# Altium project ISL6236_V01.PrjPcb
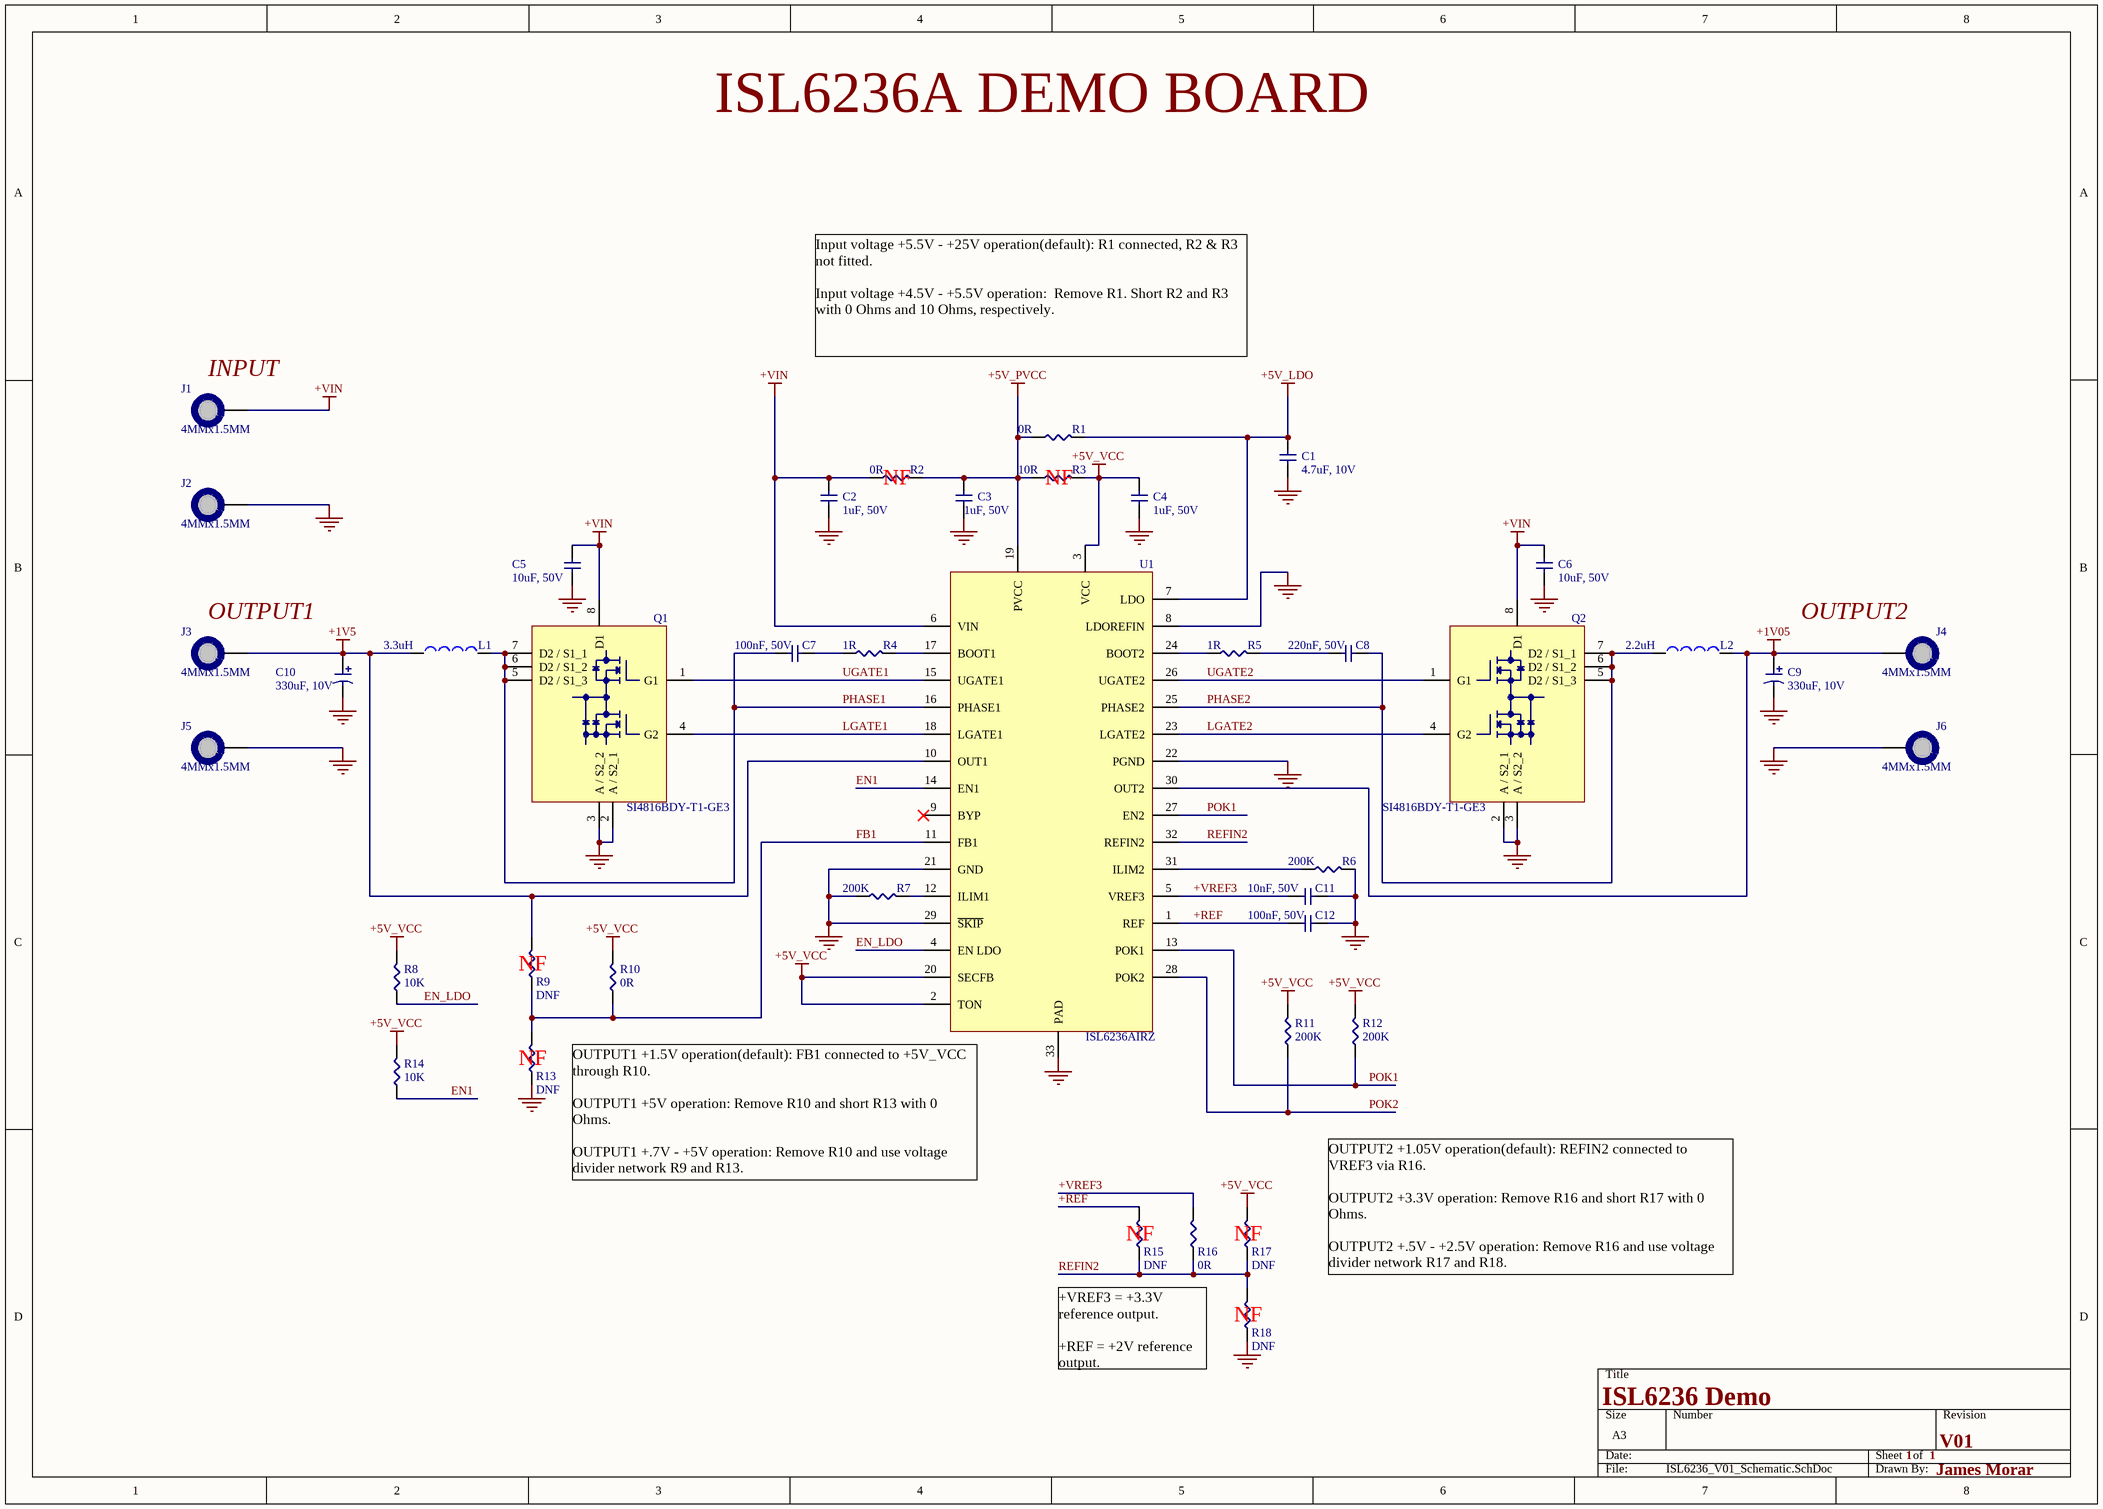
[diagram p0: ISL6236_V01_Schematic.SchDoc]
1 sheet, 41 parts. Net scope: global (net labels, ports and power ports of the same name join across sheets).
Board file: ISL6236_V01_PCB.PcbDoc

## Sheet ISL6236_V01_Schematic.SchDoc
size A3

### Parts
C1  4.7uF, 10V  [C1206]
C2  1uF, 50V  [C0805]
C3  1uF, 50V  [C0805]
C4  1uF, 50V  [C0805]
C5  10uF, 50V  [C1210]
C6  10uF, 50V  [C1210]
C7  100nF, 50V  [C0805]
C8  220nF, 50V  [C0805]
C9  330uF, 10V  [7343-43]
C10  330uF, 10V  [7343-43]
C11  10nF, 50V  [C0805]
C12  100nF, 50V  [C0805]
J1  4MMx1.5MM  [PAD_4MMx1.5MM]
J2  4MMx1.5MM  [PAD_4MMx1.5MM]
J3  4MMx1.5MM  [PAD_4MMx1.5MM]
J4  4MMx1.5MM  [PAD_4MMx1.5MM]
J5  4MMx1.5MM  [PAD_4MMx1.5MM]
J6  4MMx1.5MM  [PAD_4MMx1.5MM]
L1  3.3uH  [DR125]
L2  2.2uH  [DR125]
Q1  SI4816BDY-T1-GE3  [SO8]
Q2  SI4816BDY-T1-GE3  [SO8]
R1  0R  [R0805]
R2  0R  [R0805]
R3  10R  [R0805]
R4  1R  [R0805]
R5  1R  [R0805]
R6  200K  [R0805]
R7  200K  [R0805]
R8  10K  [R0805]
R9  DNF  [R0805]
R10  0R  [R0805]
R11  200K  [R0805]
R12  200K  [R0805]
R13  DNF  [R0805]
R14  10K  [R0805]
R15  DNF  [R0805]
R16  0R  [R0805]
R17  DNF  [R0805]
R18  DNF  [R0805]
U1  ISL6236AIRZ  [ISL6236_LQFN32]

### Nets
+1V5: C10.1 J3.1 L1.1 R9.2 U1.10(OUT1)
+1V05: C9.1 J4.1 L2.2 U1.30(OUT2)
+5V_LDO: C1.2 R1.2 U1.7(LDO)
+5V_PVCC: C3.2 R1.1 R2.2 R3.1 U1.19(PVCC)
+5V_VCC: C4.2 R3.2 R8.2 R10.2 R11.2 R12.1 R14.2 R17.2 U1.2(TON) U1.3(VCC) U1.20(SECFB)
+VIN: C2.2 C5.2 C6.2 J1.1 Q1.8(D1) Q2.8(D1) R2.1 U1.6(VIN)
GND: C1.1 C2.1 C3.1 C4.1 C5.1 C6.1 C9.2 C10.2 C11.2 C12.2 J2.1 J5.1 J6.1 Q1.2(A_/_S2_1) Q1.3(A_/_S2_2) Q2.2(A_/_S2_1) Q2.3(A_/_S2_2) R6.2 R7.1 R13.1 R18.1 U1.8(LDOREFIN) U1.21(GND) U1.22(PGND) U1.29(~{SKIP}) U1.33(PAD)
+REF: C12.1 R15.2 U1.1(REF)
+VREF3: C11.1 R16.2 U1.5(VREF3)
EN1: R14.1 U1.14(EN1)
EN_LDO: R8.1 U1.4(EN_LDO)
FB1: R9.1 R10.1 R13.2 U1.11(FB1)
LGATE1: Q1.4(G2) U1.18(LGATE1)
LGATE2: Q2.4(G2) U1.23(LGATE2)
PHASE1: C7.2 L1.2 Q1.5(D2_/_S1_3) Q1.6(D2_/_S1_2) Q1.7(D2_/_S1_1) U1.16(PHASE1)
PHASE2: C8.1 L2.1 Q2.5(D2_/_S1_3) Q2.6(D2_/_S1_2) Q2.7(D2_/_S1_1) U1.25(PHASE2)
POK1: R12.2 U1.13(POK1) U1.27(EN2)
POK2: R11.1 U1.28(POK2)
REFIN2: R15.1 R16.1 R17.1 R18.2 U1.32(REFIN2)
UGATE1: Q1.1(G1) U1.15(UGATE1)
UGATE2: Q2.1(G1) U1.26(UGATE2)
NetC7_1: C7.1 R4.1
NetC8_2: C8.2 R5.2
NetR4_2: R4.2 U1.17(BOOT1)
NetR5_1: R5.1 U1.24(BOOT2)
NetR6_1: R6.1 U1.31(ILIM2)
NetR7_2: R7.2 U1.12(ILIM1)

Not connected (* = marked no-connect by the designer): U1 9(BYP)*

### Notes on the sheet
- ISL6236A DEMO BOARD
- (near J1) INPUT
- Input voltage +5.5V - +25V operation(default): R1 connected, R2 & R3 not fitted.
  Input voltage +4.5V - +5.5V operation:  Remove R1. Short R2 and R3 with 0 Ohms and 10 Ohms, respectively.
- (near R2) NF
- (near R3) NF
- (near J3) OUTPUT1
- OUTPUT2
- (near R9) NF
- (near R13) NF
- (near U1) OUTPUT1 +1.5V operation(default): FB1 connected to +5V_VCC through R10.
  OUTPUT1 +5V operation: Remove R10 and short R13 with 0 Ohms.
  OUTPUT1 +.7V - +5V operation: Remove R10 and use voltage divider network R9 and R13.
- (near R15) NF
- (near R17) NF
- (near R18) NF
- OUTPUT2 +1.05V operation(default): REFIN2 connected to VREF3 via R16.
  OUTPUT2 +3.3V operation: Remove R16 and short R17 with 0 Ohms.
  OUTPUT2 +.5V - +2.5V operation: Remove R16 and use voltage divider network R17 and R18.
- +VREF3 = +3.3V reference output.
  +REF = +2V reference output.
- ISL6236 Demo
- 1
- V01
- James Morar

### Library data of the parts
C1 = C1206C475K8PACTU: KEMET         C1206C475K8PACTU             SMD Multilayer Ceramic Capacitor, 1206 [3216 Metric], 4.7 F, 10 V,  10%, X5R, C Series; Capacitance: 4.7 μF; Special Features: High CV; Tolerance: -10, +10 %; Voltage, Rating: 10 VDC; Supplier 1: Mouser; Manufacturer: KEMET; Manufacturer Part Number: C1206C475K8PACTU; Stock 1: 3191; Pricing 1: 1=0.48, 10=0.304, 100=0.192, 500=0.162, 1000=0.144, 2000=0.114 (USD); Brand/Series: C Series; Case Size: 1206 (3216 mm); Dielectric Characteristic: X5R; Dimensions: 0.126" x 0.063" (3.2 x 1.6mm) LxW; Material, Element: Ceramic; Mounting Type: PCB; Packaging: Cut Tape; Series: C1206 Series; Termination: SMD; ComponentLink1URL: http://www.alliedelec.com/m/d/9bfe7773041ffe9d406e68bc7b377fdd.pdf?src-supplier=Allied+Electronics; ComponentLink1Description: http://www.alliedelec.com/m/d/9bfe7773041ffe9d406e68bc7b377fdd.pdf?src-supplier=Allied+Electronics; ComponentLink2URL: http://www.jameco.com/Jameco/Products/ProdDS/1568870.pdf?src-supplier=Jameco; ComponentLink2Description: http://www.jameco.com/Jameco/Products/ProdDS/1568870.pdf?src-supplier=Jameco; Supplier Part Number 1: 80-C1206C475K8P
C2-C4 = 08055C105KAZ4A: Manufacturer: Kyocera AVX; Supplier 1: Mouser; Manufacturer Part Number: 08055C105KAZ4A; Stock 1: 7924; Pricing 1: 1=0.38, 10=0.264, 100=0.159, 500=0.119, 1000=0.1, 2500=0.085 (USD); Supplier Part Number 1: 581-08055C105KAZ4A
C5 C6 = C1210C106K5PACTU: KEMET - C1210C106K5PACTU - SMD Multilayer Ceramic Capacitor, 10 µF, 50 V, 1210 [3225 Metric], ± 10%, X5R, C Series KEMET; Product Training Modules: Capacitor Basics- Typical Uses for Capacitors; Capacitance: 10µF; Dynamic Catalog: X5R Dielectric (Commercial Grade); Other Names: 399-11402-6; Supplier 1: Mouser; Manufacturer: KEMET; Manufacturer Part Number: C1210C106K5PACTU; Stock 1: 17950; Pricing 1: 1=1.29, 10=0.986, 100=0.705, 500=0.546, 1000=0.382, 2000=0.363, 10000=0.349, 25000=0.28 (USD); Standard Package: 1; Category: Capacitors; Family: Ceramic Capacitors; Series: -; Packaging: Digi-Reel®; Tolerance: ±10%; Voltage - Rated: 50V; Temperature Coefficient: X5R; Mounting Type: Surface Mount, MLCC; Operating Temperature: -55°C ~ 85°C; Applications: General Purpose; Ratings: -; Package / Case: 1210 (3225 Metric); Size / Dimension: 0.126" L x 0.098" W (3.20mm x 2.50mm); Height - Seated (Max): -; Thickness (Max): *; Lead Spacing: -; Features: -; Lead Style: -; ComponentLink1URL: https://api.kemet.com/component-edge/download/datasheet/C1210C106K5PACTU.pdf?src-supplier=Digi-Key; ComponentLink1Description: https://api.kemet.com/component-edge/download/datasheet/C1210C106K5PACTU.pdf?src-supplier=Digi-Key; Supplier Part Number 1: 80-C1210C106K5P
C7 C12 = C0805C104K5RAC7411: Cap Ceramic 0.1uF 50V X7R 10% SMD 0805 125C Paper T/R; Manufacturer: KEMET; Rad Hard: No; Voltage: 50 Vdc; Product Length: 2 mm; Product Height: 0.9 mm; Product Depth: 1.25 mm; Supplier 1: Mouser; Manufacturer Part Number: C0805C104K5RAC7411; Stock 1: 57173; Pricing 1: 1=0.1, 10=0.049, 100=0.032, 500=0.03, 1000=0.025, 2000=0.021 (USD); Packaging: Tape & Reel; Package/Case: 0805; Mounting: Surface Mount; Capacitance Value: 0.1 uF; Tolerance: 10 %; Dielectric: X7R; Operating Temperature: -55 to 125 °C; Construction: Flat; Category: Capacitor Ceramic Multilayer; ComponentLink1URL: https://www.verical.com/server-webapp/html/getDatasheet?partID=248513&src-supplier=Verical; ComponentLink1Description: https://www.verical.com/server-webapp/html/getDatasheet?partID=248513&src-supplier=Verical; ComponentLink2URL: http://components.arrow.com/part/dataview/30748302S8994022N7429?src-supplier=Arrow; ComponentLink2Description: http://components.arrow.com/part/dataview/30748302S8994022N7429?src-supplier=Arrow; ComponentLink3URL: http://components.arrow.com/part/dataview/0323_00325482?src-supplier=Arrow+Europe; ComponentLink3Description: http://components.arrow.com/part/dataview/0323_00325482?src-supplier=Arrow+Europe; Supplier Part Number 1: 80-C0805C104K5RACLR
C8 = C0805F224K5RACAUTO: Cap Ceramic 0.22uF 50V X7R 10% SMD 0805 125°C Embossed Plastic T/R; Manufacturer: KEMET; Capacitance: .22uF; Voltage: 50VDC; Case Style: Ceramic Chip; Wire Form: Not Required; Product Length (mm): 2mm; Product Depth (mm): 1.25mm; Product Diameter (mm): Not Requiredmm; Supplier 1: Mouser; Manufacturer Part Number: C0805F224K5RACAUTO; Stock 1: 3880; Pricing 1: 1=0.57, 10=0.363, 100=0.219, 500=0.198, 1000=0.168, 2500=0.13 (USD); Tolerance (+ or -): 10%; Temp Coeff (Dielectric): X7R; Operating Temp Range: -55C to 125C; Mounting Style: Surface Mount; Package / Case: 0805; Construction: SMT Chip; Failure Rate: Not Required; Product Height (mm): 1.25mm; Packaging: Tape and Reel; ComponentLink1URL: http://components.arrow.com/part/dataview/0323_04088687?src-supplier=Arrow+Europe; ComponentLink1Description: http://components.arrow.com/part/dataview/0323_04088687?src-supplier=Arrow+Europe; ComponentLink2URL: https://api.kemet.com/component-edge/download/datasheet/C0805F224K5RACAUTO.pdf?src-supplier=Digi-Key; ComponentLink2Description: https://api.kemet.com/component-edge/download/datasheet/C0805F224K5RACAUTO.pdf?src-supplier=Digi-Key; Supplier Part Number 1: 80-C0805F224K5RAUTO
C9 C10 = T530X337M010ATE004: Tantalum Capacitors - Polymer SMD 330uF 10volts 20%; Manufacturer: KEMET; Mfr Case Code: X Case; ESR: 4 mOhms; Case Length: 7.3 mm; Case Width: 4.3 mm; Dissipation Factor DF: 8; Leakage Current: 330 uA; Ripple Current: 8.2 A; Type: Conductive Polymer Chip Capacitors Low ESR; Supplier 1: Mouser; Manufacturer Part Number: T530X337M010ATE004; Stock 1: 5172; Pricing 1: 1=6.86, 10=6.09, 100=4.87, 250=4.87, 500=3.68, 1000=3.37 (USD); Dimensions: 4.3 mm W x 7.3 mm L; Product Category: Tantalum Capacitors - Polymer SMD; RoHS: Details; Brand: Kemet; Capacitance: 330 uF; Voltage Rating: 10 V; Tolerance: 20 %; Case Code - in: 2917; Case Code - mm: 7343; Height: 4.3 mm; Operating Temperature Range: - 55 C to + 125 C; Package / Case: 2917 (7343 metric); Packaging: Reel; Product: Tantalum Organic Polymer Standard Grade; Series: T530; Factory Pack Quantity: 500; Termination Style: SMD/SMT; Tradename: KO-CAP; Voltage Rating DC: 10 V; ComponentLink1URL: https://www.alliedelec.com/m/d/c2b5846d1b4015924ec44504ba06510b.pdf?src-supplier=Allied+Electronics; ComponentLink1Description: https://www.alliedelec.com/m/d/c2b5846d1b4015924ec44504ba06510b.pdf?src-supplier=Allied+Electronics; ComponentLink2URL: http://uk.rs-online.com/webdocs/1529/0900766b815291cb.pdf?src-supplier=RSComponents; ComponentLink2Description: http://uk.rs-online.com/webdocs/1529/0900766b815291cb.pdf?src-supplier=RSComponents; Supplier Part Number 1: 80-T530X337M010ATE4
C11 = C0805X103K5RAC7210: Cap, 0.01?F, 50V, 10%, X7R, 0805; Manufacturer: KEMET; Supplier 1: Mouser; Manufacturer Part Number: C0805X103K5RAC7210; Stock 1: 13697; Pricing 1: 1=0.34, 10=0.203, 100=0.122, 500=0.111, 1000=0.1, 2000=0.083 (USD); Supplier Part Number 1: 80-C0805X103K5R7210
J1-J6 = PAD_4MMx1.5MM: 4MMx1.5MM pad
L1 = DR125-3R3-R: FIXED IND 3.3UH 9.26A 6.3 MOHM; Manufacturer: Eaton Cooper; Type: Wirewound; Material - Core: Ferrite; Inductance: 3.3µH; Tolerance: ±20%; Current - Saturation: 12.7A; Shielding: Shielded; Frequency - Test: 100kHz; Supplier 1: Mouser; Manufacturer Part Number: DR125-3R3-R; Stock 1: 368; Pricing 1: 1=2.03, 10=1.88, 100=1.32, 600=0.901, 1200=0.862, 2400=0.842, 4800=0.822, 9600=0.795, 24600=0.769 (USD); Category: Inductors, Coils, Chokes; Family: Fixed Inductors; Series: DR; Packaging: Digi-Reel®; Current Rating: 9.26A; DC Resistance (DCR): 6.3 mOhm; Q @ Freq: -; Frequency - Self Resonant: -; Ratings: -; Operating Temperature: -40°C ~ 125°C; Mounting Type: Surface Mount; Package / Case: Nonstandard; Size / Dimension: 0.492" L x 0.492" W (12.50mm x 12.50mm); Height - Seated (Max): 0.236" (6.00mm); ComponentLink1URL: https://www.verical.com/server-webapp/html/getDatasheet?partID=251124&src-supplier=Verical; ComponentLink1Description: https://www.verical.com/server-webapp/html/getDatasheet?partID=251124&src-supplier=Verical; ComponentLink2URL: http://www.farnell.com/datasheets/87246.pdf?src-supplier=Farnell; ComponentLink2Description: http://www.farnell.com/datasheets/87246.pdf?src-supplier=Farnell; ComponentLink3URL: http://www.cooperindustries.com/content/dam/public/bussmann/Electronics/Resources/product-datasheets/Bus_Elx_DS_4315_DR_Series.pdf?src-supplier=Future+Electronics; ComponentLink3Description: http://www.cooperindustries.com/content/dam/public/bussmann/Electronics/Resources/product-datasheets/Bus_Elx_DS_4315_DR_Series.pdf?src-supplier=Future+Electronics; ComponentLink4URL: http://www.onlinecomponents.com/productFiles/mf-COI/4a32919a-7470-4ae0-be45-b59e3a1351ef.pdf?src-supplier=Onlinecomponents.com; ComponentLink4Description: http://www.onlinecomponents.com/productFiles/mf-COI/4a32919a-7470-4ae0-be45-b59e3a1351ef.pdf?src-supplier=Onlinecomponents.com; Supplier Part Number 1: 704-DR125-3R3-R
L2 = DR125-2R2-R: FIXED IND 2.2UH 10.9A 4.5 MOHM; Manufacturer: Eaton Cooper; Type: Wirewound; Material - Core: Ferrite; Inductance: 2.2µH; Tolerance: ±20%; Current - Saturation: 15A; Shielding: Shielded; Frequency - Test: 100kHz; Supplier 1: Mouser; Manufacturer Part Number: DR125-2R2-R; Stock 1: 606; Pricing 1: 1=1.98, 10=1.83, 100=1.28, 600=1.11, 1200=0.924, 2400=0.842 (USD); Category: Inductors, Coils, Chokes; Family: Fixed Inductors; Series: DR; Packaging: Tape & Reel (TR); Current Rating: 10.9A; DC Resistance (DCR): 4.5 mOhm; Q @ Freq: -; Frequency - Self Resonant: -; Ratings: -; Operating Temperature: -40°C ~ 125°C; Mounting Type: Surface Mount; Package / Case: Nonstandard; Size / Dimension: 0.492" L x 0.492" W (12.50mm x 12.50mm); Height - Seated (Max): 0.236" (6.00mm); ComponentLink1URL: https://www.verical.com/server-webapp/html/getDatasheet?partID=571249&src-supplier=Verical; ComponentLink1Description: https://www.verical.com/server-webapp/html/getDatasheet?partID=571249&src-supplier=Verical; ComponentLink2URL: http://uk.rs-online.com/webdocs/116a/0900766b8116a153.pdf?src-supplier=RSComponents; ComponentLink2Description: http://uk.rs-online.com/webdocs/116a/0900766b8116a153.pdf?src-supplier=RSComponents; ComponentLink3URL: http://www.farnell.com/datasheets/87246.pdf?src-supplier=Element14; ComponentLink3Description: http://www.farnell.com/datasheets/87246.pdf?src-supplier=Element14; Supplier Part Number 1: 704-DR125-2R2-R
Q1 Q2 = SI4816BDY-T1-GE3: MOSFET 2N-CH 30V 5.8A 8-SOIC; Manufacturer: Vishay Siliconix; FET Type: 2 N-Channel (Half Bridge); FET Feature: Logic Level Gate; Current - Continuous Drain (Id) @ 25°C: 5.8A, 8.2A; Rds On (Max) @ Id, Vgs: 18.5 mOhm @ 6.8A, 10V; Vgs(th) (Max) @ Id: 3V @ 250µA; Gate Charge (Qg) @ Vgs: 10nC @ 5V; Power - Max: 1W, 1.25W; Online Catalog: N-Channel Logic Level Gate FETs; Other Names: SI4816BDY-T1-GE3DKR; Supplier 1: Mouser; Manufacturer Part Number: SI4816BDY-T1-GE3; Stock 1: 4312; Pricing 1: 1=1.61, 10=1.4, 100=1.1, 500=0.955, 1000=0.791, 2500=0.715 (USD); Standard Package: 1; Category: Discrete Semiconductor Products; Family: FETs - Arrays; Series: LITTLE FOOT®; Packaging: Digi-Reel®; Drain to Source Voltage (Vdss): 30V; Mounting Type: Surface Mount; Package / Case: 8-SOIC (0.154", 3.90mm Width); Supplier Device Package: 8-SO; ComponentLink1URL: http://www.farnell.com/datasheets/1911984.pdf?src-supplier=Element14; ComponentLink1Description: http://www.farnell.com/datasheets/1911984.pdf?src-supplier=Element14; ComponentLink2URL: http://www.farnell.com/datasheets/2049212.pdf?src-supplier=Element14; ComponentLink2Description: http://www.farnell.com/datasheets/2049212.pdf?src-supplier=Element14; ComponentLink3URL: http://www.vishay.com/docs/73026/si4816bd.pdf?src-supplier=Future+Electronics; ComponentLink3Description: http://www.vishay.com/docs/73026/si4816bd.pdf?src-supplier=Future+Electronics; ComponentLink4URL: http://www.vishay.com/docs/73026/si4816bd.pdf?src-supplier=Digi-Key; ComponentLink4Description: http://www.vishay.com/docs/73026/si4816bd.pdf?src-supplier=Digi-Key; ComponentLink5URL: http://www.vishay.com/docs/73026/si4816bd.pdf?src-supplier=Avnet; ComponentLink5Description: http://www.vishay.com/docs/73026/si4816bd.pdf?src-supplier=Avnet; ComponentLink6URL: http://datasheet.iiic.cc/vishay_[siliconix]/SI4816BDY-T1-GE3.pdf?src-supplier=IIIC; ComponentLink6Description: http://datasheet.iiic.cc/vishay_[siliconix]/SI4816BDY-T1-GE3.pdf?src-supplier=IIIC; Supplier Part Number 1: 781-SI4816BDY-T1-GE3
R1 R2 R10 R16 = CRCW08050000Z0EAC: RES SMD 0 OHM JUMP 1/8W 0805; Manufacturer: Vishay; Supplier 1: Mouser; Manufacturer Part Number: CRCW08050000Z0EAC; Stock 1: 191061; Pricing 1: 1=0.1, 10=0.039, 100=0.015, 1000=0.006, 5000=0.004, 10000=0.004, 25000=0.003 (USD); ComponentLink1URL: http://www.vishay.com/docs/28773/crcwce3.pdf?src-supplier=Digi-Key; ComponentLink1Description: http://www.vishay.com/docs/28773/crcwce3.pdf?src-supplier=Digi-Key; Supplier Part Number 1: 71-CRCW08050000Z0EAC
R3 = CRCW080510R0FKEAC: RES SMD 10 OHM 1% 1/8W 0805; Manufacturer: Vishay; Supplier 1: Mouser; Manufacturer Part Number: CRCW080510R0FKEAC; Stock 1: 155502; Pricing 1: 1=0.1, 10=0.059, 100=0.024, 1000=0.01, 5000=0.007, 10000=0.006, 25000=0.005 (USD); ComponentLink1URL: http://www.vishay.com/docs/20035/dcrcwe3.pdf?src-supplier=Avnet; ComponentLink1Description: http://www.vishay.com/docs/20035/dcrcwe3.pdf?src-supplier=Avnet; ComponentLink2URL: http://www.vishay.com/docs/28773/crcwce3.pdf?src-supplier=Digi-Key; ComponentLink2Description: http://www.vishay.com/docs/28773/crcwce3.pdf?src-supplier=Digi-Key; Supplier Part Number 1: 71-CRCW080510R0FKEAC
R4 R5 = ERJ-6BQF1R0V: Res Thick Film 0805 1 Ohm 1% 1/3W ±200ppm/°C Molded SMD SMD Punched Carrier T/R; Manufacturer: Panasonic; Resistance: 1 Ohms; Power Rating: 250 mW (1/4 W); Temperature Coefficient: 200 PPM / C; Case Height: 0.6 mm; Case Length: 2 mm; Case Width: 1.2 mm; Supplier 1: Mouser; Manufacturer Part Number: ERJ-6BQF1R0V; Stock 1: 17387; Pricing 1: 1=0.47, 10=0.334, 100=0.133, 500=0.112, 1000=0.061, 5000=0.05 (USD); Product Category: Current Sense Resistors; RoHS: Details; Tolerance: 1 %; Case Code - in: 0805; Case Code - mm: 2012; Operating Temperature Range: - 55 C to + 125 C; Brand: Panasonic; Package / Case: 0805 (2012 metric); Packaging: Reel; Product: Thick Film Resistors SMD; Series: ERJ-6BQ; Factory Pack Quantity: 5000; Termination Style: SMD/SMT; Type: Thick Film Resistors, Low Resistance Type; ComponentLink1URL: http://uk.rs-online.com/webdocs/13b8/0900766b813b869e.pdf?src-supplier=RSComponents; ComponentLink1Description: http://uk.rs-online.com/webdocs/13b8/0900766b813b869e.pdf?src-supplier=RSComponents; ComponentLink2URL: http://industrial.panasonic.com/www-data/pdf/AOA0000/AOA0000CE3.pdf?src-supplier=Avnet+Europe; ComponentLink2Description: http://industrial.panasonic.com/www-data/pdf/AOA0000/AOA0000CE3.pdf?src-supplier=Avnet+Europe; ComponentLink3URL: https://www.distrelec.biz/Web/Downloads/_t/ds/ERJ_eng_tds.pdf?mime=application%2Fpdf&src-supplier=Distrelec; ComponentLink3Description: https://www.distrelec.biz/Web/Downloads/_t/ds/ERJ_eng_tds.pdf?mime=application%2Fpdf&src-supplier=Distrelec; ComponentLink4URL: http://www.farnell.com/datasheets/2244535.pdf?src-supplier=Farnell; ComponentLink4Description: http://www.farnell.com/datasheets/2244535.pdf?src-supplier=Farnell; ComponentLink5URL: http://industrial.panasonic.com/www-data/pdf/AOA0000/AOA0000CE3.pdf?src-supplier=Avnet; ComponentLink5Description: http://industrial.panasonic.com/www-data/pdf/AOA0000/AOA0000CE3.pdf?src-supplier=Avnet; Supplier Part Number 1: 667-ERJ-6BQF1R0V
R6 R7 R11 R12 = ERJ-S06F2003V: Res Thick Film 0805 200K Ohm 1% 0.125W(1/8W) ±100ppm/C Sulfur Resistant Molded SMD Automotive Punched T/R; Manufacturer: Panasonic; Power (Watts): 0.125W, 1/8W; Temperature Coefficient: ±100ppm/°C; Product Training Modules: Automotive Resistor Products; Other Names: ERJS06F2003V; Supplier 1: Mouser; Manufacturer Part Number: ERJ-S06F2003V; Stock 1: 5699; Pricing 1: 1=0.38, 10=0.15, 100=0.064, 1000=0.046, 5000=0.024, 10000=0.024 (USD); Series: ERJ; Resistance (Ohms): 200K; Composition: Thick Film; Features: Anti-Sulfur; Tolerance: ±1%; Package / Case: 0805 (2012 Metric); Size / Dimension: 0.079" L x 0.049" W (2.00mm x 1.25mm); Height: 0.028" (0.70mm); Number of Terminations: 2; Packaging: Tape & Reel (TR); Standard Package: 5,000; Category: Resistors; Family: Chip Resistor - Surface Mount; Supplier Device Package: 0805; ComponentLink1URL: http://www.mouser.com/ds/2/315/AOA0000CE5-49157.pdf?src-supplier=Mouser; ComponentLink1Description: http://www.mouser.com/ds/2/315/AOA0000CE5-49157.pdf?src-supplier=Mouser; ComponentLink2URL: http://www.industrial.panasonic.com/www-data/pdf/AOA0000/AOA0000CE5.pdf?src-supplier=Avnet; ComponentLink2Description: http://www.industrial.panasonic.com/www-data/pdf/AOA0000/AOA0000CE5.pdf?src-supplier=Avnet; Supplier Part Number 1: 667-ERJ-S06F2003V
R8 R14 = CRCW080510K0FKEAC: RES SMD 10K OHM 1% 1/8W 0805; Manufacturer: Vishay; Supplier 1: Mouser; Manufacturer Part Number: CRCW080510K0FKEAC; Stock 1: 334869; Pricing 1: 1=0.1, 10=0.059, 100=0.024, 1000=0.01, 5000=0.007, 10000=0.006, 25000=0.005 (USD); ComponentLink1URL: http://www.vishay.com/docs/28773/crcwce3.pdf?src-supplier=Digi-Key; ComponentLink1Description: http://www.vishay.com/docs/28773/crcwce3.pdf?src-supplier=Digi-Key; Supplier Part Number 1: 71-CRCW080510K0FKEAC
R9 R13 R15 R17 R18 = RES
U1 = ISL6236AIRZ: IC MAIN PWR CTRLR QUAD 32-QFN; Manufacturer: Renesas; Categories: Integrated Circuits (ICs); Voltage - Input: 4.5 V ~ 25 V; Number of Outputs: 4; Voltage - Output: Multiple; Supplier 1: Mouser; Manufacturer Part Number: ISL6236AIRZ; Stock 1: 0; Pricing 1: 1=6.09, 10=5.18, 100=4.49, 250=4.26, 500=3.82, 1000=3.22 (USD); Series: -; Packaging: Tube; Part Status: Active; Applications: Controller, Notebook Power System; Operating Temperature: -40°C ~ 100°C; Mounting Type: Surface Mount; Package / Case: 32-VFQFN Exposed Pad; Supplier Device Package: 32-QFN (5x5); Base Part Number: ISL6236; Supplier Part Number 1: 968-ISL6236AIRZ

## Assembly variants
Default: not fitted R2 R3 R9 R13 R15 R17 R18